# EAGLE design waterlevel (EAGLE 7.3.0)
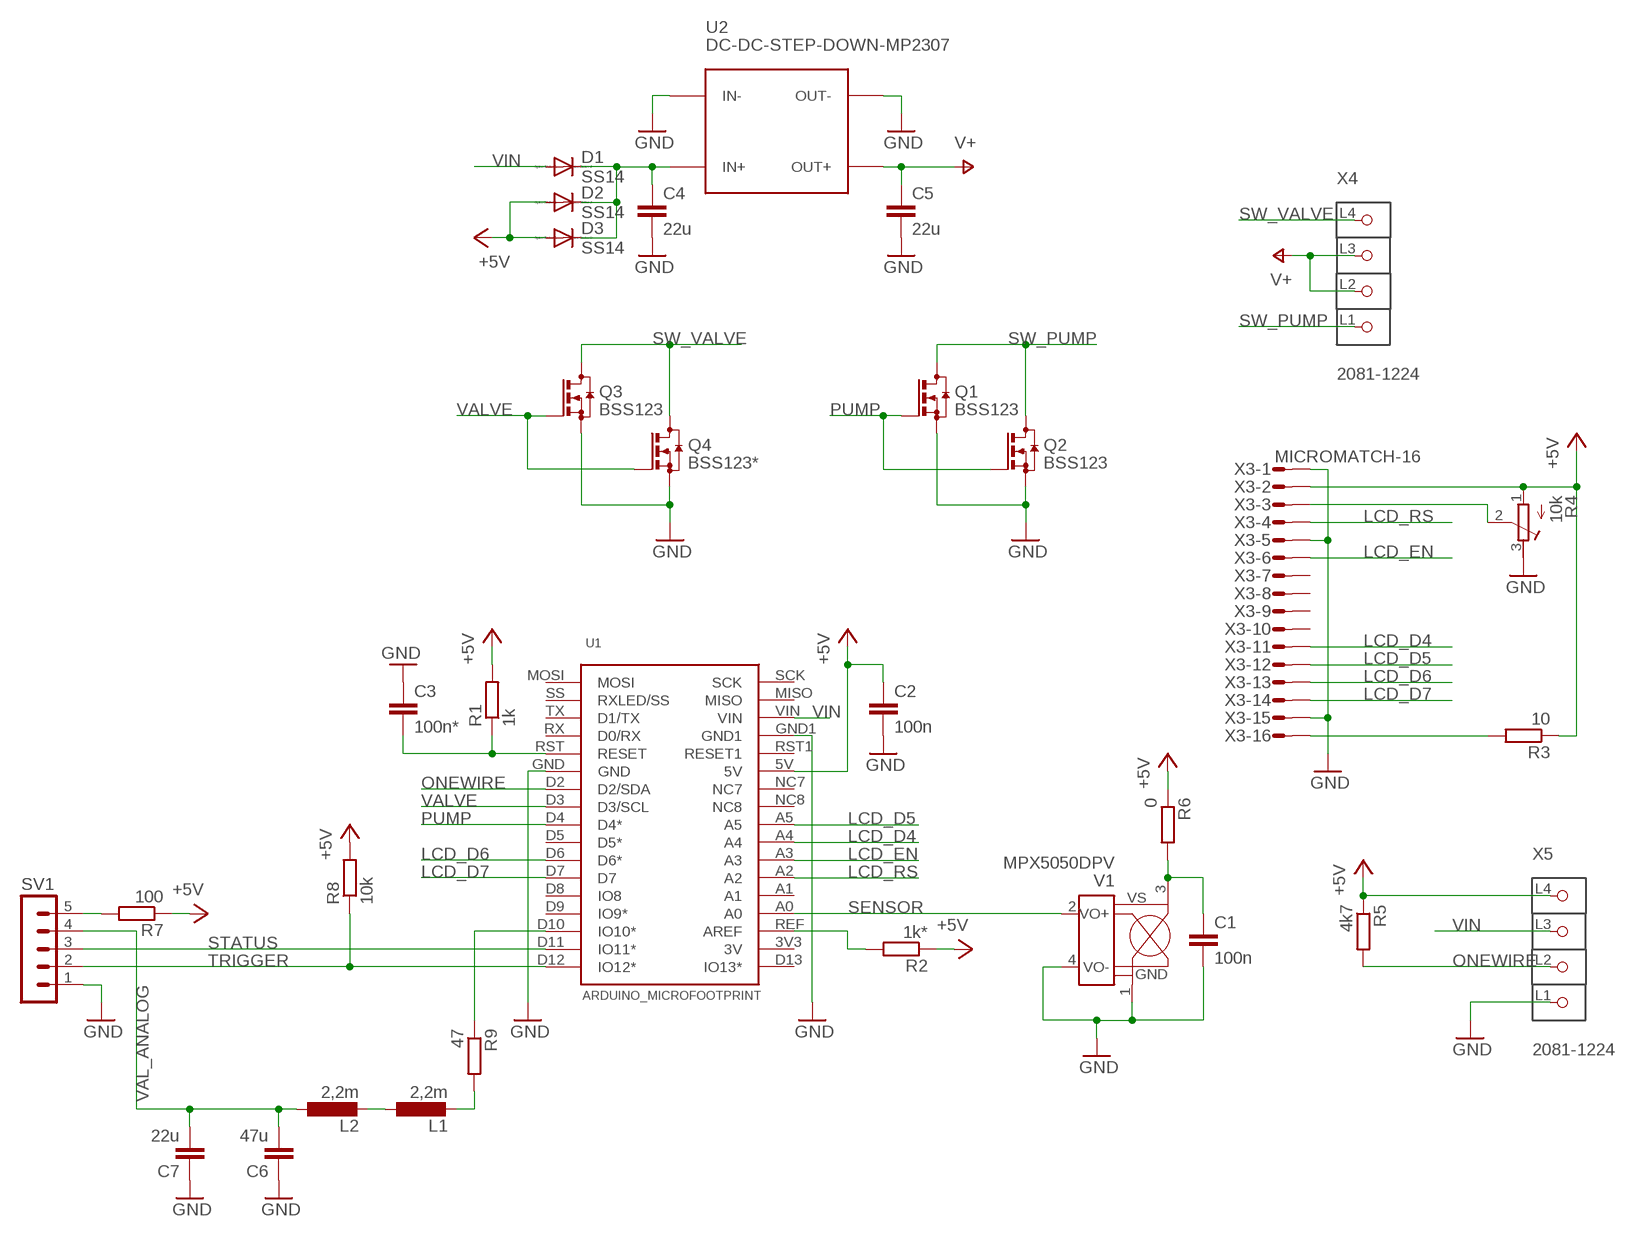
[diagram p0: schematic, sheet 1]

## Parts
C1  100n  C-EUC0603  [C0603]
C2  100n  C-EUC0603  [C0603]
C3  100n*  C-EUC0603  [C0603]
C4  22u  C-EUC1210K  [C1210K]
C5  22u  C-EUC1210K  [C1210K]
C6  47u  C-EUC1206K  [C1206K]
C7  22u  C-EUC1206K  [C1206K]
D1  SS14  DIODE-DO214AC  [DO214AC]
D2  SS14  DIODE-DO214AC  [DO214AC]
D3  SS14  DIODE-DO214AC  [DO214AC]
L1  2,2m  L-EUL1812  [L1812]
L2  2,2m  L-EUL1812  [L1812]
Q1  BSS123  [SOT23]
Q2  BSS123  [SOT23]
Q3  BSS123  [SOT23]
Q4  BSS123*  BSS123  [SOT23]
R1  1k  R-EU_R0603  [R0603]
R2  1k*  R-EU_R0603  [R0603]
R3  10  R-EU_R0603  [R0603]
R4  10k  R-TRIMM64Z  [RTRIM64Z]
R5  4k7  R-EU_R0603  [R0603]
R6  0  R-EU_R0603  [R0603]
R7  100  R-EU_R0603  [R0603]
R8  10k  R-EU_R0603  [R0603]
R9  47  R-EU_R0603  [R0603]
SV1  MA05-1  [MA05-1]
U1  ARDUINO_MICROFOOTPRINT  [ARDUINO-MICRO]
U2  DC-DC-STEP-DOWN-MP2307  [DC-DC-STEP-DOWN-MP2307]
V1  MPX5050DPV  MPX2050DPV  [MPX2050DPV]
X3  MICROMATCH-16  [MICROMATCH-16]
X4  2081-1224  [P-2081-1224]
X5  2081-1224  [P-2081-1224]

## Nets
+5V: C2.1 D2.A D3.A R1.2 R2.1 R3.1 R4.1(A) R5.1 R6.1 R7.1 R8.2 U1.5V X3.2 X5.L4(P4)
GND: C1.2 C2.2 C3.1 C4.2 C5.2 C6.1 C7.1 Q1.2(S) Q2.2(S) Q3.2(S) Q4.2(S) R4.3(E) SV1.1 U1.GND U1.GND1 U2.IN- U2.OUT- V1.1(GND) V1.4(VO-) X3.1 X3.5 X3.15 X5.L1(P1)
LCD_D4: U1.A4 X3.11
LCD_D5: U1.A5 X3.12
LCD_D6: U1.D6(D6*) X3.13
LCD_D7: U1.D7 X3.14
LCD_EN: U1.A3 X3.6
LCD_RS: U1.A2 X3.4
N$1: C4.1 D1.C D2.C D3.C U2.IN+
N$2: C3.2 R1.1 U1.RST(RESET)
N$3: R2.2 U1.REF(AREF)
N$4: R4.2(S) X3.3
N$5: C1.1 R6.2 V1.3(VS)
N$6: R7.2 SV1.5
N$7: R9.1 U1.D10(IO10*)
N$8: R3.2 X3.16
N$9: L1.2 R9.2
N$10: L1.1 L2.2
ONEWIRE: R5.2 U1.D2(D2/SDA) X5.L2(P2)
PUMP: Q1.1(G) Q2.1(G) U1.D4(D4*)
SENSOR: U1.A0 V1.2(VO+)
STATUS: SV1.3 U1.D11(IO11*)
SW_PUMP: Q1.3(D) Q2.3(D) X4.L1(P1)
SW_VALVE: Q3.3(D) Q4.3(D) X4.L4(P4)
TRIGGER: R8.1 SV1.2 U1.D12(IO12*)
V+: C5.1 U2.OUT+ X4.L2(P2) X4.L3(P3)
VAL_ANALOG: C6.2 C7.2 L2.1 SV1.4
VALVE: Q3.1(G) Q4.1(G) U1.D3(D3/SCL)
VIN: D1.A U1.VIN X5.L3(P3)
Unconnected: U1.3V3(3V) U1.A1 U1.D5(D5*) U1.D8(IO8) U1.D9(IO9*) U1.D13(IO13*) U1.MISO U1.MOSI U1.NC7 U1.NC8 U1.RST1(RESET1) U1.RX(D0/RX) U1.SCK U1.SS(RXLED/SS) U1.TX(D1/TX) X3.7 X3.8 X3.9 X3.10

## Library data of the parts
C1-C7 = rcl:C-EU: CAPACITOR, European symbol
D1-D3 = diode:DIODE-: DIODE
L1 L2 = rcl:L-EU: INDUCTOR, European symbol
Q1-Q4 = transistor-small-signal:BSS123: N-CHANNEL MOS FET
R1-R3 R5-R9 = rcl:R-EU_: RESISTOR, European symbol
R4 = rcl:R-TRIMM: Trimm resistor
SV1 = con-lstb:MA05-1: PIN HEADER; OC_FARNELL: unknown; OC_NEWARK: unknown
U1 = arduino-micro:ARDUINO_MICRO
U2 = diy-modules:DC-DC-STEP-DOWN-MP2307: DC/DC Step-Down Regulator based on MP2307DN chip MP2307 datasheet available here: https://cdn-shop.adafruit.com/datasheets/MP2307_r1.9.pdf Click here to find device on ebay.com <http://www.ebay.com/sch/dc+dc+3a+mini+converter>
V1 = motorola-sensor-driver:MPX2050*: 50 kPa Pressure Sensor On-Chip Temparetur Compensated & Calibrated Silicon Pressure Sensor; MF: MOTOROLA; MPN: MPX2050DP; OC_FARNELL: 3506642; OC_NEWARK: 48F6766
X3 = con-amp-micromatch:MICROMATCH-16: MicroMaTch 16 8-215464-6 / 1-215464-6 Drawing Number C-215464 DDEController.pdf; MF: FARNELL; MPN: 8-215464-6; OC_FARNELL: 3784680; OC_NEWARK: 26H3309
X4 X5 = con-wago_2081:2081-1224: Serie 2081, Klemmenleiste mit Betätigungsdrückern mit abgewinkelten Lötstiften versetzt (alternierend) / Series 2081, Terminal strip with push-buttons with angled, staggered solder pins Polzahl / Pole No.: 4 Rastermaß / Pitch: 3.5 mm Bemessungsspannung / Rated Voltage: 320 V Nennstrom / Nominal Current: 17.5 A Leiterquerschnitt / Conductor Size: 0.2 - 1.5 mm2 Anschlusstechnik / Connection Technology: CAGE CLAMP® S Lötstiftlänge: / Solder Pin Length: 3.6 mm Leitereinführung (zur Platine) / Conductor entry angle (to PCB): 0 ° Farbe / Color: grau / gray Stand: 01.01.2014. Die jeweils aktuellen Daten zu diesem Artikel finden Sie in unserem Produktkatalog, den Sie unter www.wago.com einsehen können. As of: 01/01/2014. Please find the newest data for this article in our product catalogue, which can be viewed under www.wago.com.

## Board
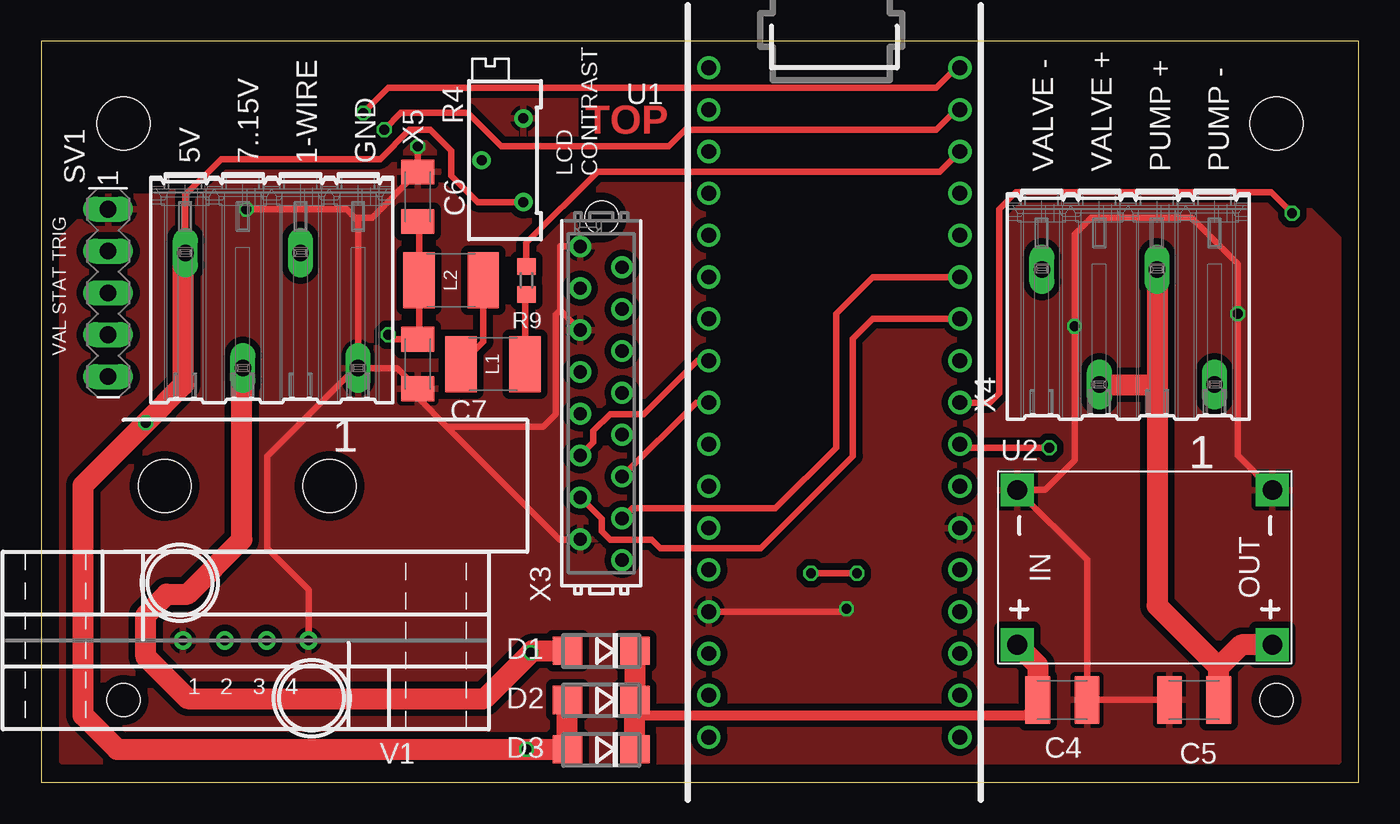
[diagram p1: board, top side]
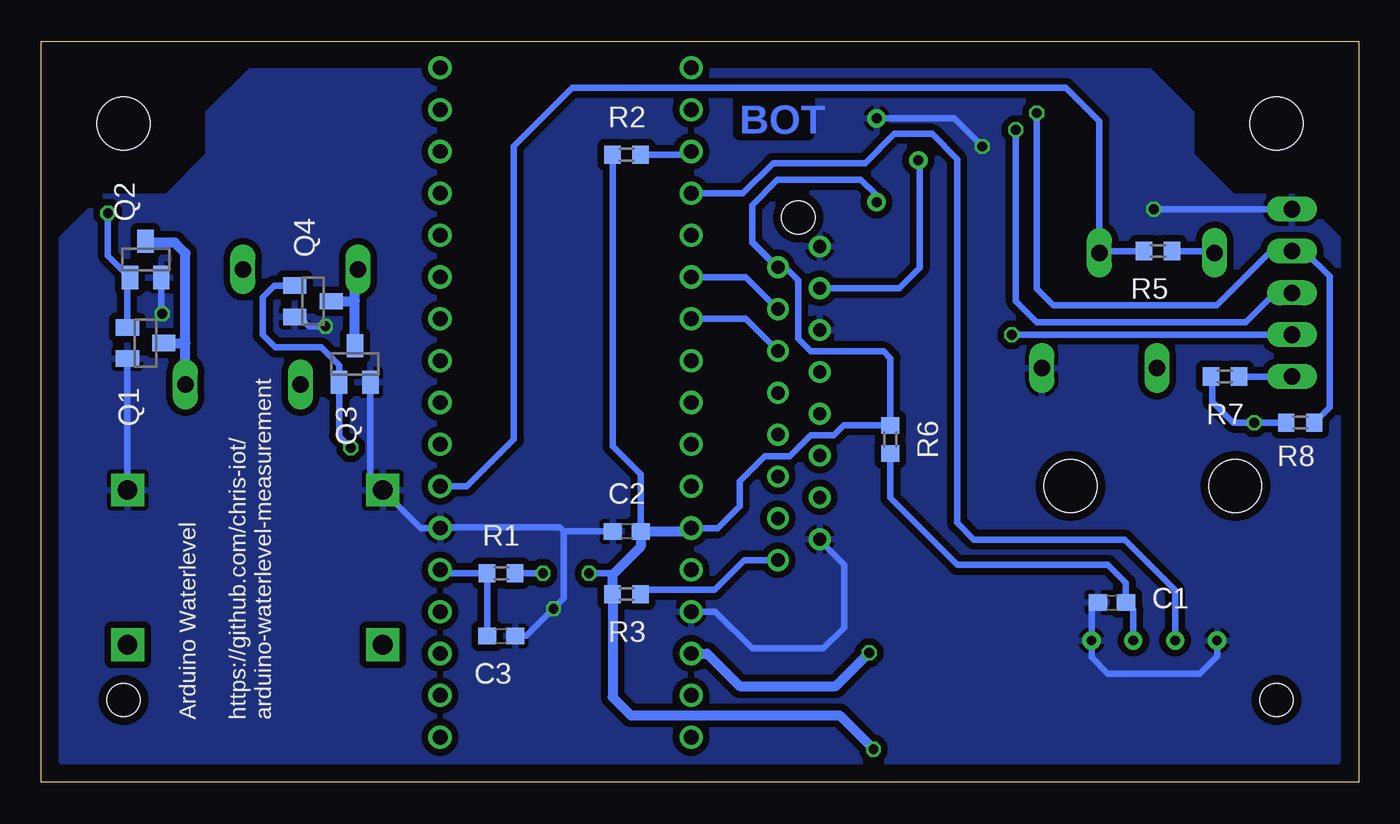
[diagram p2: board, bottom side, seen from below]

Size 80 x 45 mm. Coordinates in mm from the lower left corner, seen from the top.
Outline: 0,0 80,0 80,45 0,45 0,0
Copper layers (1*16): Top 0.035mm / dielectric 1.5mm / Bottom 0.035mm
Design rules "ShenZhen2U_2layer_EagleRules": minimum track width 7mil, minimum drill 12mil, track to track 7mil, track to pad 7mil, pad to pad 7mil, via to via 7mil, smd to smd 0mil, copper to edge 20mil, drill to drill 10mil, minimum pad ring 10mil, minimum via ring 6mil, stop-mask expansion 2mil, vias tented up to drill 25mil, thermal gap 10mil
Holes 3.2 mm at 5,40 75,40 7.5,18 17.5,18
Holes 2 mm at 5,5 75,5 34.04,34.29

### Footprints (pad centres in the part's own frame; a part is rotated, then mirrored left to right if it is on the bottom)
C0603 = smd 1.1 x 1: 1 -0.85,0; 2 0.85,0
C1210K = smd 1.5 x 2.9: 1 -1.5,0; 2 1.5,0
C1206K = smd 1.5 x 2: 1 -1.5,0; 2 1.5,0
DO214AC = smd 1.8 x 1.7: A 2.05,0; C -2.05,0
L1812 = smd 1.9 x 3.4: 1 -1.95,0; 2 1.95,0
SOT23 = smd 1 x 1.4: 1 -0.95,-1.1; 2 0.95,-1.1; 3 0,1.1
R0603 = smd 1 x 1.1: 1 -0.85,0; 2 0.85,0
RTRIM64Z = drill 0.61: 1 0,-2.54; 2 -2.54,0; 3 0,2.54
MA05-1 = drill 1.016 long: 1 -5.08,0; 2 -2.54,0; 3 0,0; 4 2.54,0; 5 5.08,0
ARDUINO-MICRO = drill 0.9: 3V3 16.51,3.81; 5V 16.51,29.21; A0 16.51,8.89; A1 16.51,11.43; A2 16.51,13.97; A3 16.51,16.51; A4 16.51,19.05; A5 16.51,21.59; D2 1.27,26.67; D3 1.27,24.13; D4 1.27,21.59; D5 1.27,19.05; D6 1.27,16.51; D7 1.27,13.97; D8 1.27,11.43; D9 1.27,8.89; D10 1.27,6.35; D11 1.27,3.81; D12 1.27,1.27; D13 16.51,1.27; GND 1.27,29.21; GND1 16.51,34.29; MISO 16.51,39.37; MOSI 1.27,41.91; NC7 16.51,26.67; NC8 16.51,24.13; REF 16.51,6.35; RST 1.27,31.75; RST1 16.51,31.75; RX 1.27,34.29; SCK 16.51,41.91; SS 1.27,39.37; TX 1.27,36.83; VIN 16.51,36.83
DC-DC-STEP-DOWN-MP2307 = drill 1.2 pad 2 square: IN+ -7.747,-4.699; IN- -7.747,4.699; OUT+ 7.747,-4.699; OUT- 7.747,4.699
MPX2050DPV = drill 0.6: 1 -3.81,0; 2 -1.27,0; 3 1.27,0; 4 3.81,0
MICROMATCH-16 = drill 0.813: 1 9.525,1.27; 2 8.255,-1.27; 3 6.985,1.27; 4 5.715,-1.27; 5 4.445,1.27; 6 3.175,-1.27; 7 1.905,1.27; 8 0.635,-1.27; 9 -0.635,1.27; 10 -1.905,-1.27; 11 -3.175,1.27; 12 -4.445,-1.27; 13 -5.715,1.27; 14 -6.985,-1.27; 15 -8.255,1.27; 16 -9.525,-1.27
P-2081-1224 = drill 1 long: L1 -4.85,-5.25; L2 2.15,-1.75; L3 -4.85,1.75; L4 2.15,5.25

### Placement (x,y rotation side)
C1  14.99,10.92 180 bottom
C2  44.45,15.24 180 bottom
C3  52.07,8.89 180 bottom
C4  62,5 0 top
C5  70,5 180 top
C6  22.86,35.56 270 top
C7  22.86,25.4 90 top
D1  34,8 180 top
D2  34,5 180 top
D3  34,2 180 top
L1  27.43,25.4 0 top
L2  24.89,30.48 0 top
Q1  73.66,26.67 270 bottom
Q2  73.66,31.75 0 bottom
Q3  60.96,25.4 0 bottom
Q4  63.5,29.21 270 bottom
R1  52.07,12.7 0 bottom
R2  44.45,38.1 0 bottom
R3  44.45,11.43 0 bottom
R4  29.28,37.77 0 top
R5  12.19,32.26 180 bottom
R6  28.45,20.83 270 bottom
R7  8.13,24.64 0 bottom
R8  3.56,21.84 180 bottom
R9  29.46,30.48 270 top
SV1  4.06,29.72 270 top
U1  57.05,44.65 180 top
U2  67.01,13.05 0 top
V1  12.42,8.61 0 top
X3  34,23.02 90 top
X4  66,29 90 top
X5  14,30 90 top

### Tracks (layer width: path | path; a pad name or v marks a point on that pad's centre or on a via)
+5V  (via drill 0.6)
  Top 0.406: X5.L4 8.75,35.67 10.92,37.85 20.57,37.85 22.35,39.62 23.62,39.62 24.89,38.35 24.89,36.83 26.49,35.23 R4.1 | v49.53,12.7 v46.74,12.7
  Top 1.27: D2.A D3.A v29.46,2 4.6,2 2.54,4.06 2.54,18.03 v6.35,21.84 8.64,24.13 8.64,32.04 X5.L4
  Bottom 0.406: R5.1 8.86,32.26 X5.L4 | U1.5V 38.92,15.44 37.59,16.76 37.59,18.29 36.07,19.81 34.54,19.81 33.27,21.08 31.88,21.08 31.28,21.68 R6.1 28.45,25.76 28.85,26.16 33.27,26.16 34.04,26.92 34.04,30.48 34.8,31.24 35.31,31.24 36.83,32.77 36.83,32.83 | R2.1 45.3,20.41 43.6,18.71 C2.1 | R1.2 v49.53,12.7 | v46.74,12.7 45.39,12.7 45.3,12.61 | R8.2 v6.35,21.84 7.62,21.84 8.89,23.11 8.89,24.55 R7.1 | R4.1 29.28,35.63 30.23,36.58 35.31,36.58 36.83,35.05 36.83,32.83 | X3.2 36.83,32.83
  Bottom 0.61: U1.5V 40.74,15.24 C2.1 43.6,14.31 45.3,12.61 R3.1 45.3,5.17 44.2,4.06 31.53,4.06 v29.46,2
GND  (via drill 0.6)
  Top 0.406: X3.15 32.7,14.73 31.5,14.73 24.64,21.59 | X3.1 31.52,32.54 31.52,28.67 | X5.L1 19.05,25.15 13.72,19.81 13.72,14.22 16.26,11.68 16.26,8.64 V1.4 | U1.GND1 48.71,10.36 v48.9,10.54 | C5.2 C4.2 63.5,13.51 U2.IN- 59.29,17.78 60.96,17.78 62.74,19.56 v62.74,27.69 62.74,33.27 63.75,34.29 69.85,34.29 72.64,31.5 v72.64,28.45 72.64,19.86 U2.OUT- | 24.64,21.59 22.86,23.37 C7.1 21.61,25.15 X5.L1 | X3.5 31.52,28.67 | 31.52,28.67 31.24,28.38 31.24,22.35 30.48,21.59 24.64,21.59 | v12.45,34.8 18.54,34.8 19.05,34.29 | 19.05,34.29 19.25,34.09 X5.L1 | 19.05,34.29 20.09,34.29 C6.1 v22.86,38.61
  Bottom 0.406: C1.2 16.23,10.53 V1.4 16.23,7.59 15.24,6.6 9.65,6.6 8.61,7.65 V1.1 | X3.15 32.73,14.7 31.24,13.21 31.24,9.4 32.51,8.13 36.83,8.13 39.06,10.36 U1.GND1 | C3.1 50.55,8.89 v48.9,10.54 48.26,11.18 48.26,15.24 | C2.2 48.26,15.24 | 48.26,15.24 48.51,15.49 55.73,15.49 U1.GND 56.95,15.44 U2.IN- 60.01,18.5 Q3.2 | Q4.2 64.33,28.26 63.75,27.69 v62.74,27.69 | Q1.2 U2.OUT- | Q2.2 72.71,28.51 v72.64,28.45 | SV1.1 v12.45,34.8 | v22.86,38.61 24.56,40.31 R4.3
  pour Top (isolate 0.406): 1.27,1.27 1.27,33.02 3.81,35.56 7.62,35.56 10.16,38.1 10.16,40.64 12.7,43.18 67.31,43.18 69.85,40.64 69.85,38.1 72.39,35.56 76.2,35.56 78.74,33.02 78.74,1.27
  pour Bottom (isolate 0.406): 1.27,33.02 3.81,35.56 7.62,35.56 10.16,38.1 10.16,40.64 12.7,43.18 67.31,43.18 69.85,40.64 69.85,38.1 72.39,35.56 76.2,35.56 78.74,33.02 78.74,1.27 1.27,1.27
LCD_D4
  Top 0.406: X3.11 33.53,20.64 33.53,21.34 34.54,22.35 36.58,22.35 39.82,25.6 U1.A4
LCD_D5
  Top 0.406: X3.12 39.76,23.06 U1.A5
LCD_D6
  Top 0.406: X3.13 34.04,15.99 34.04,15.24 34.54,14.73 37.08,14.73 37.59,14.22 43.69,14.22 49.28,19.81 49.28,26.92 50.49,28.14 U1.D6
LCD_D7
  Top 0.406: X3.14 35.88,16.64 44.58,16.64 48.26,20.32 48.26,28.45 50.49,30.68 U1.D7
LCD_EN
  Bottom 0.406: U1.A3 37.22,28.14 X3.6
LCD_RS
  Bottom 0.406: U1.A2 37.22,30.68 X3.4
N$1
  Top 0.61: D2.C 36.05,4.06 59.82,4.06 60.5,4.75 C4.1
  Top 1.27: D1.C D2.C D3.C | U2.IN+ 60.5,7.11 C4.1
N$2
  Bottom 0.406: U1.RST 55.58,12.7 R1.1 C3.2
N$3
  Bottom 0.406: R2.2 40.74,38.1 U1.REF
N$4
  Bottom 0.406: R4.2 26.67,37.7 26.67,31.24 27.91,30 X3.3
N$5
  Bottom 0.406: V1.3 13.69,10.48 C1.1 14.14,12.1 15.24,13.21 24.38,13.21 28.45,17.27 R6.2
N$6
  Bottom 0.406: R7.2 SV1.5
N$7
  Top 0.406: R9.1 29.46,32.77 33.78,37.08 54.56,37.08 U1.D10
N$8
  Bottom 0.406: R3.2 43.35,11.68 39.12,11.68 37.31,13.49 X3.16
N$9
  Top 0.406: R9.2 29.38,29.55 L1.2
N$10
  Top 0.406: L1.1 26.84,26.76 L2.2
ONEWIRE
  Bottom 0.406: R5.2 15.64,32.26 X5.L2 15.75,40.13 17.78,42.16 47.75,42.16 51.31,38.61 51.31,20.83 54.16,17.98 U1.D2
PUMP  (via drill 0.6)
  Top 0.406: U1.D4 57.6,23.06 58.17,23.62 58.17,34.8 59.18,35.81 74.68,35.81 v75.95,34.54
  Bottom 0.406: Q1.1 74.76,30.5 Q2.1 75.95,31.99 v75.95,34.54
SENSOR
  Bottom 0.406: V1.2 11.15,11.66 14.22,14.73 23.37,14.73 24.38,15.75 24.38,37.85 25.91,39.37 28.19,39.37 29.97,37.59 35.56,37.59 37.39,35.76 U1.A0
STATUS  (via drill 0.6)
  Top 0.406: v20.83,39.62 21.84,40.64 25.91,40.64 27.94,38.61 38.1,38.61 39.12,39.62 54.36,39.62 55.57,40.84 U1.D11
  Bottom 0.406: SV1.3 5.08,29.72 6.86,27.94 19.56,27.94 20.83,29.21 v20.83,39.62
SW_PUMP
  Bottom 0.61: X4.L1 71.25,26.67 | 71.25,26.67 71.25,32.13 71.88,32.77 73.58,32.77 Q2.3 | Q1.3 71.25,26.67
SW_VALVE
  Bottom 0.61: Q3.3 60.96,29.21 | 60.96,29.21 60.96,30.94 X4.L4 | Q4.3 60.96,29.21
TRIGGER  (via drill 0.6)
  Top 0.406: v19.56,40.64 21.08,42.16 54.36,42.16 55.57,43.38 U1.D12
  Bottom 0.406: R8.1 1.78,22.77 1.78,30.73 3.3,32.26 SV1.2 5.33,32.26 8.64,28.96 18.54,28.96 19.56,29.97 v19.56,40.64
V+
  Top 1.27: U2.OUT+ 72.87,8.35 71.5,6.98 | C5.1 71.5,6.98 | X4.L2 67.75,24.13 | 67.75,24.13 67.75,10.73 71.5,6.98 | X4.L3 67.73,24.15 67.75,24.13
VAL_ANALOG  (via drill 0.6)
  Top 0.406: v21.08,27.18 21.36,26.9 C7.2 22.94,26.98 L2.1 22.94,30.99 22.94,33.98 C6.2
  Bottom 0.406: SV1.4 v21.08,27.18
VALVE  (via drill 0.6)
  Top 0.406: v61.21,20.32 55.98,20.32 U1.D3
  Bottom 0.406: Q4.1 65.85,30.16 66.55,29.46 66.55,27.18 65.79,26.42 62.99,26.42 61.91,25.33 Q3.1 61.91,21.02 v61.21,20.32
VIN  (via drill 0.6)
  Top 1.27: D1.A 29.84,8 v29.72,7.87 26.92,5.08 8.89,5.08 6.35,7.62 6.35,10.16 7.62,11.43 8.89,11.43 12.19,14.73 12.19,25.09 X5.L3
  Bottom 0.61: 29.77,7.82 v29.72,7.87 31.75,5.84 37.59,5.84 39.57,7.82 U1.VIN

### Text on the board
Top: TOP
Bottom: BOT
tPlace: 5V | 7..15V | 1-WIRE | GND | LCD / CONTRAST | VALVE - | VALVE + | PUMP + | PUMP - | VAL STAT TRIG | 1 2 3 4
bPlace: Arduino Waterlevel / / https://github.com/chris-iot/ / arduino-waterlevel-measurement